# EAGLE design sa612_upconverter (EAGLE 7.7.0)
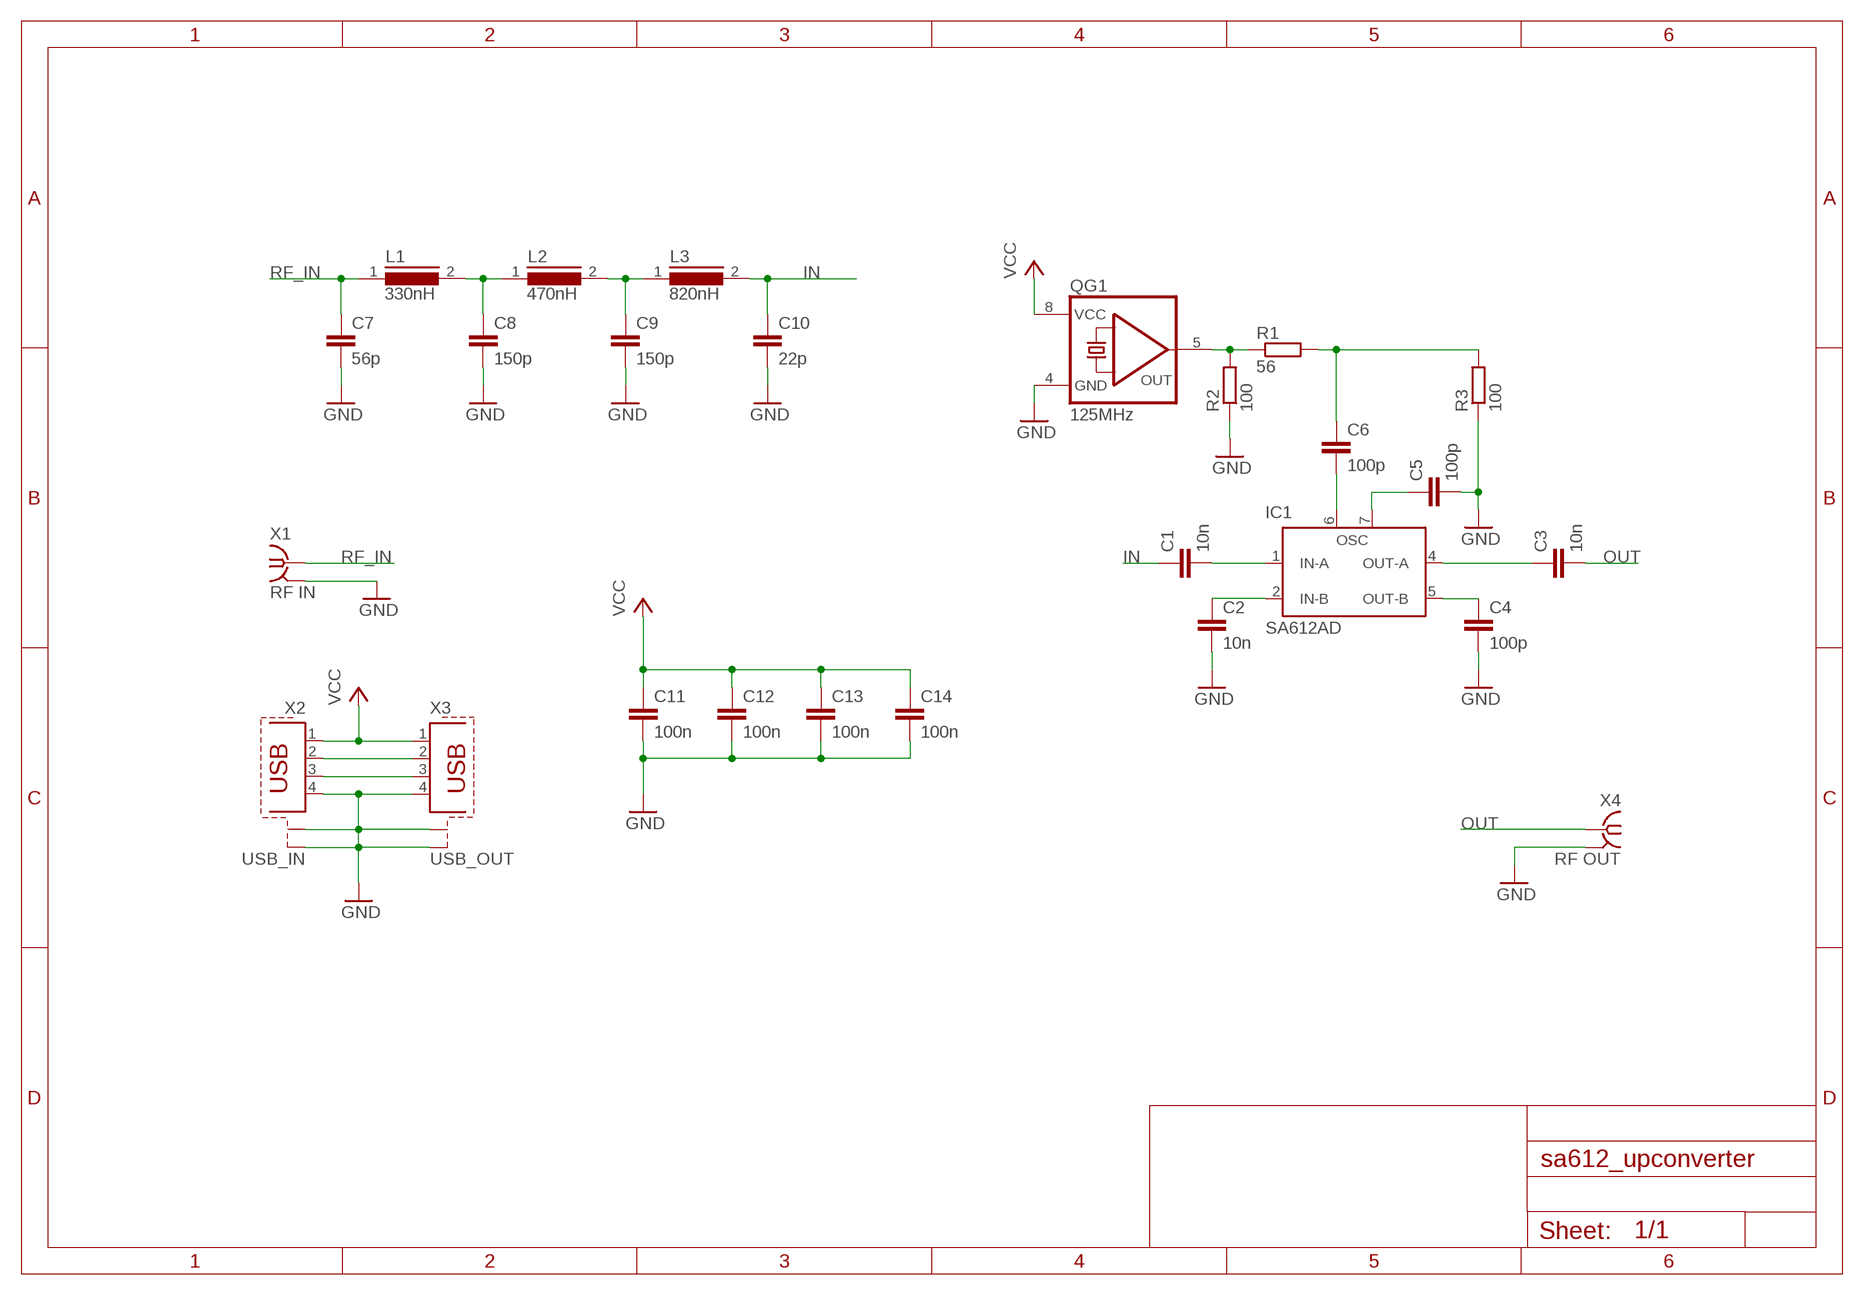
[diagram p0: schematic, sheet 1]

## Parts
C1  10n  C2.5/2  [C2.5-2]
C2  10n  C2.5/2  [C2.5-2]
C3  10n  C2.5/2  [C2.5-2]
C4  100p  C2.5/2  [C2.5-2]
C5  100p  C7.5/3  [C7.5B3]
C6  100p  C2.5/2  [C2.5-2]
C7  56p  C2.5/2  [C2.5-2]
C8  150p  C2.5/2  [C2.5-2]
C9  150p  C2.5/2  [C2.5-2]
C10  22p  C2.5/2  [C2.5-2]
C11  100n  C2.5/2  [C2.5-2]
C12  100n  C2.5/2  [C2.5-2]
C13  100n  C2.5/2  [C2.5-2]
C14  100n  C2.5/2  [C2.5-2]
IC1  SA612AD  [SO08]
L1  330nH  ED16  [ED16]
L2  470nH  ED16  [ED16]
L3  820nH  ED16  [ED16]
QG1  125MHz  QG5460  [DIL08S]
R1  56  R-EU_0204/7  [0204/7]
R2  100  R-EU_0204/7  [0204/7]
R3  100  R-EU_0204/7  [0204/7]
X1  RF IN  BU-SMA-H  [BU-SMA-H]
X2  USB_IN  PN61729-S  [PN61729-S]
X3  USB_OUT  PN87520-S  [PN87520-S]
X4  RF OUT  BU-SMA-V  [BU-SMA-V]

## Nets
GND: C2.2 C4.2 C5.2 C7.2 C8.2 C9.2 C10.2 C11.2 C12.2 C13.2 C14.2 QG1.4(GND) R2.1 R3.1 X1.2 X1.3 X1.4 X1.5 X2.4 X2.S1 X2.S2 X3.4 X3.S1 X3.S2 X4.2 X4.3 X4.4 X4.5
IN: C1.1 C10.1 L3.2
N$1: QG1.5(OUT) R1.1 R2.2
N$2: C4.1 IC1.5(OUT-B)
N$3: C3.1 IC1.4(OUT-A)
N$4: C1.2 IC1.1(IN-A)
N$5: C2.1 IC1.2(IN-B)
N$6: C5.1 IC1.7(OSC')
N$7: C6.1 R1.2 R3.2
N$8: C6.2 IC1.6(OSC)
N$10: C8.1 L1.2 L2.1
N$11: C9.1 L2.2 L3.1
N$12: X2.2 X3.2
N$13: X2.3 X3.3
OUT: C3.2 X4.1
RF_IN: C7.1 L1.1 X1.1
VCC: C11.1 C12.1 C13.1 C14.1 QG1.8(VCC) X2.1 X3.1

## Power pins joined to a net without a drawn wire
GND: IC1.3(GND)
VCC: IC1.8(VCC)

## Library data of the parts
C1-C14 = capacitor-wima:C: CAPACITOR naming: grid - package width
IC1 = linear:SA612A: Double-balanced mixer and oscillator NE612/SA612 Source: www-eu2.semiconductors.philips.com/acrobat/datasheets/SA612A.pdf
L1-L3 = inductors:ED16: INDUCTOR
QG1 = crystal:QG5460: CRYSTAL RESONATOR; OC_FARNELL: unknown; OC_NEWARK: unknown
R1-R3 = rcl:R-EU_: RESISTOR, European symbol
X1 = con-coax:BU-SMA-H: FEMALE SMA CONNECTOR Radiall; OC_FARNELL: unknown; OC_NEWARK: unknown
X2 = con-berg:PN61729-S: BERG USB connector; OC_FARNELL: unknown; OC_NEWARK: unknown
X3 = con-berg:PN87520-S; OC_FARNELL: unknown; OC_NEWARK: unknown
X4 = con-coax:BU-SMA-V: FEMALE SMA CONNECTOR Radiall distributor RS 112-3794; OC_FARNELL: unknown; OC_NEWARK: unknown

## Board
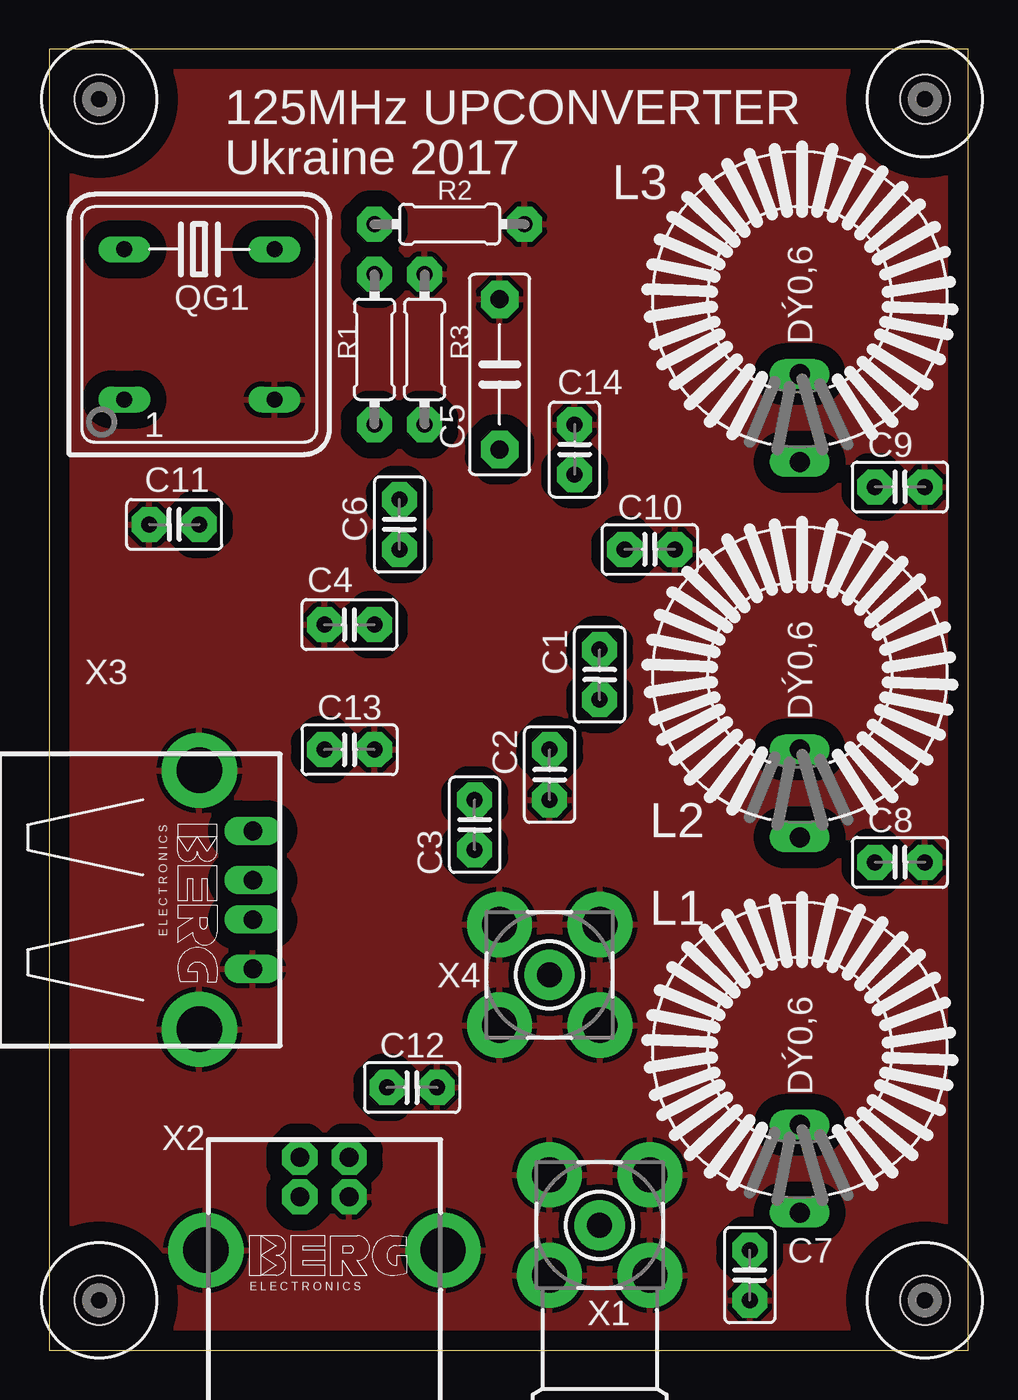
[diagram p1: board, top side]
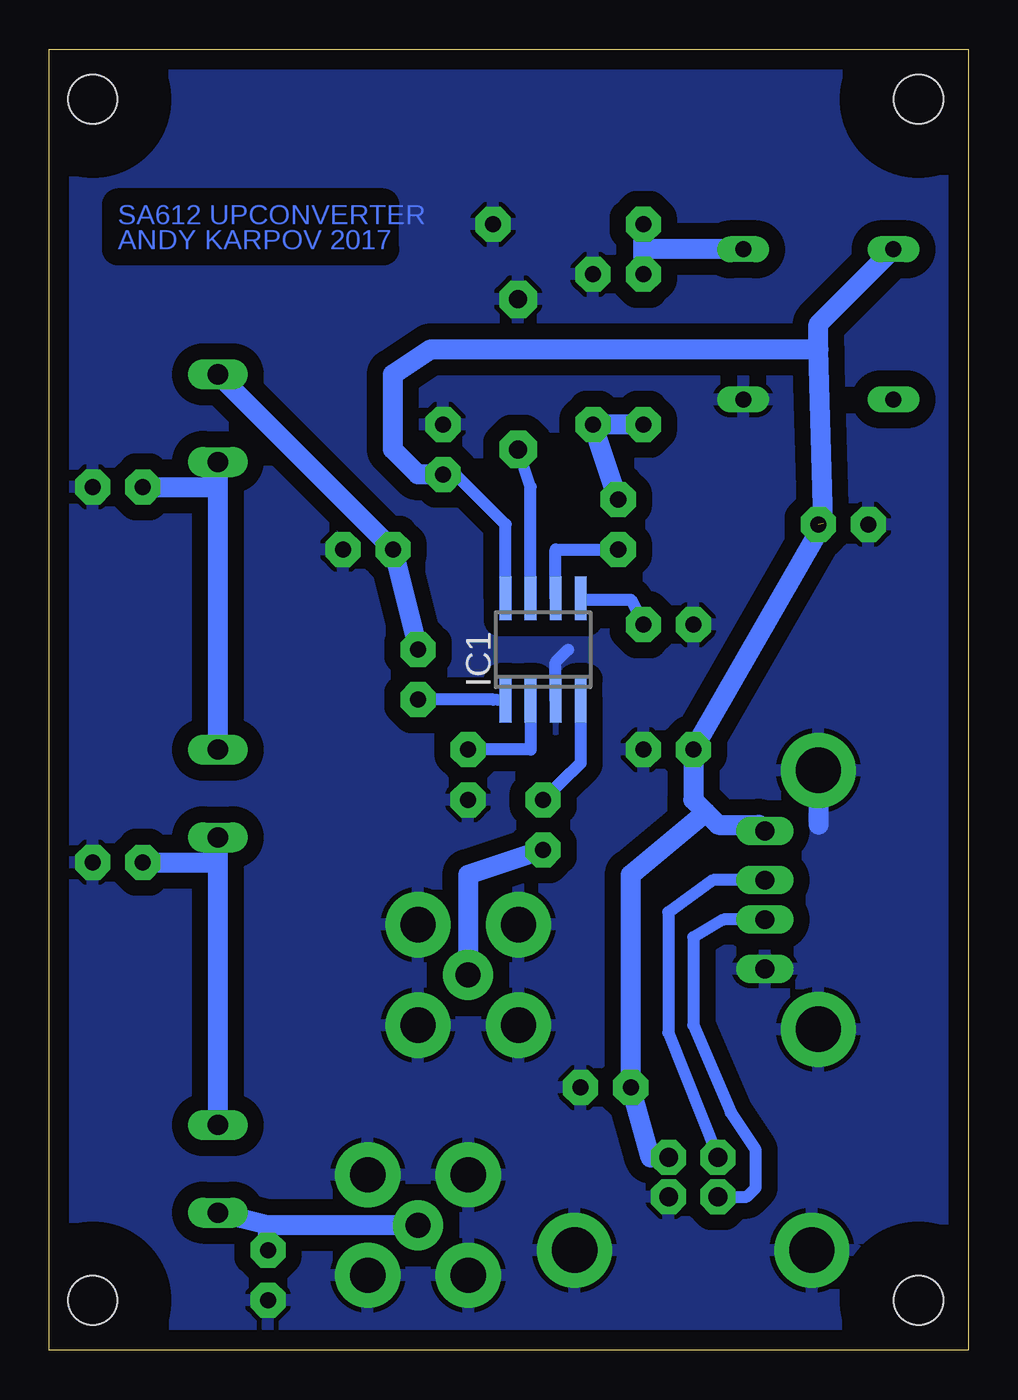
[diagram p2: board, bottom side, seen from below]

Size 46.66 x 66.03 mm. Coordinates in mm from the lower left corner, seen from the top.
Outline: 0,0 46.66,0 46.66,66.03 0,66.03 0,0
Copper layers (1*16): Top 0.035mm / dielectric 1.5mm / Bottom 0.035mm
Design rules "default": minimum track width 10mil, minimum drill 24mil, track to track 8mil, track to pad 8mil, pad to pad 8mil, via to via 8mil, smd to smd 8mil, copper to edge 40mil, drill to drill 8mil, minimum pad ring 10mil, minimum via ring 8mil, stop-mask expansion 4mil, vias tented up to drill 0mil, thermal gap 10mil

### Footprints (pad centres in the part's own frame; a part is rotated, then mirrored left to right if it is on the bottom)
C2.5-2 = drill 0.813 pad 1.778 octagon: 1 -1.27,0; 2 1.27,0
C7.5B3 = drill 0.914 pad 1.905 octagon: 1 -3.81,0; 2 3.81,0
SO08 = smd 0.6 x 2.2: 1 -1.905,-2.6; 2 -0.635,-2.6; 3 0.635,-2.6; 4 1.905,-2.6; 5 1.905,2.6; 6 0.635,2.6; 7 -0.635,2.6; 8 -1.905,2.6
ED16 = drill 1.016 long: 1 -8.255,0; 2 -3.81,0
DIL08S = drill 0.813 long: 1 -3.81,-3.81; 4 3.81,-3.81; 5 3.81,3.81; 8 -3.81,3.81
0204/7 = drill 0.813 pad 1.778 octagon: 1 -3.81,0; 2 3.81,0
DRIL-2,5 = hole 2.5: 0,0
BU-SMA-H = drill 1.27 pad 2.54: 1 0,0 | drill 1.778 pad 3.302: 2 -2.55,2.55; 3 2.55,2.55; 4 2.55,-2.55; 5 -2.55,-2.55
PN61729-S = drill 0.95 pad 1.778 octagon: 1 1.25,4.71; 2 -1.25,4.71; 3 -1.25,2.71; 4 1.25,2.71 | drill 2.3 pad 3.81: S1 -6.02,0; S2 6.02,0
PN87520-S = drill 0.95 long: 1 -3.5,2.71; 2 -1,2.71; 3 1,2.71; 4 3.5,2.71 | drill 2.3 pad 3.81: S1 -6.57,0; S2 6.57,0
BU-SMA-V = drill 1.27 pad 2.54: 1 0,0 | drill 1.778 pad 3.302: 2 -2.55,2.55; 3 2.55,2.55; 4 2.55,-2.55; 5 -2.55,-2.55

### Placement (x,y rotation side)
C1  27.94,34.29 270 top
C2  25.4,29.21 270 top
C3  21.59,26.67 270 top
C4  15.24,36.83 180 top
C5  22.86,49.53 90 top
C6  17.78,41.91 270 top
C7  35.56,3.81 270 top
C8  43.18,24.77 0 top
C9  43.18,43.81 0 top
C10  30.48,40.64 0 top
C11  6.35,41.91 180 top
C12  18.41,13.34 0 top
C13  15.24,30.48 0 top
C14  26.67,45.72 90 top
IC1  21.59,35.56 0 bottom
L1  38.1,15.24 90 top
L2  38.1,34.29 90 top
L3  38.1,53.34 90 top
QG1  7.62,52.07 0 top
R1  16.51,50.8 270 top
R2  20.32,57.15 180 top
R3  19.05,50.8 270 top
U$1  [DRIL-2,5]  2.54,2.54 0 top
U$2  [DRIL-2,5]  44.45,2.54 0 top
U$3  [DRIL-2,5]  2.54,63.5 0 top
U$4  [DRIL-2,5]  44.45,63.5 0 top
X1  27.94,6.35 270 top
X2  13.97,5.08 0 top
X3  7.62,22.86 270 top
X4  25.4,19.05 0 top

### Tracks (layer width: path | path; a pad name or v marks a point on that pad's centre or on a via)
GND
  Bottom 0.61: IC1.3 20.95,34.92 20.32,35.56
  Bottom 1.016: X3.S1 7.62,26.67
  pour Bottom (isolate 0.813): 0,66.04 46.99,66.04 46.99,0 0,0
  pour Top (isolate 0.813): 0,66.04 46.99,66.04 46.99,0 0,0
IN
  Bottom 1.016: L3.2 C10.1 C1.1
N$1
  Bottom 1.016: R1.1 16.51,55.88 | 16.51,55.88 R2.2 | QG1.5 16.51,55.88
N$2
  Bottom 0.61: IC1.5 19.68,38.1 17.14,38.1 C4.1
N$3
  Bottom 0.61: IC1.4 19.68,29.79 C3.1
N$4
  Bottom 0.61: IC1.1 24.13,33.02 C1.2
N$5
  Bottom 0.61: IC1.2 22.23,30.48 C2.1
N$6
  Bottom 0.61: IC1.7 22.23,43.81 C5.1
N$7
  Bottom 1.016: C6.1 R3.2 R1.2
N$8
  Bottom 0.61: IC1.6 20.95,40.64 C6.2
N$10
  Bottom 1.016: L2.1 38.1,24.77 | C8.1 38.1,24.77 | 38.1,24.77 L1.2
N$11
  Bottom 1.016: L3.1 38.1,43.81 | C9.1 38.1,43.81 | 38.1,43.81 L2.2
N$12
  Bottom 0.61: X3.2 12.97,23.86 15.24,22.23 15.24,16.12 X2.2
N$13
  Bottom 0.61: X3.3 12.43,21.86 13.97,20.95 13.97,16.51 12.06,12.06 10.8,10.16 10.8,8.26 11.26,7.79 X2.3
OUT
  Bottom 1.016: C3.2 25.4,24.13 X4.1
RF_IN
  Bottom 1.016: X1.1 35.56,6.35 | 35.56,6.35 L1.1 | C7.1 35.56,6.35
VCC  (1 unrouted)
  Bottom 0.61: IC1.8 23.49,41.91 26.03,44.45 C14.1
  Bottom 1.016: 7.62,50.8 7.38,41.96 C13.1 13.97,27.94 13.34,27.3 | 7.62,50.8 7.62,52.07 QG1.8 | C14.1 27.94,44.45 29.21,45.72 29.21,49.53 27.3,50.8 7.62,50.8 | X2.1 16.14,9.79 C12.1 17.14,24.13 13.34,27.3 | 13.34,27.3 12.7,26.67 10.64,26.67 X3.1

### Text on the board
Bottom: SA612 UPCONVERTER / ANDY KARPOV 2017
tPlace: 125MHz UPCONVERTER | Ukraine 2017